# Altium schematic sheet 12-AM64x-01.SchDoc
size B; SheetNumber: 12; SheetTotal: 25
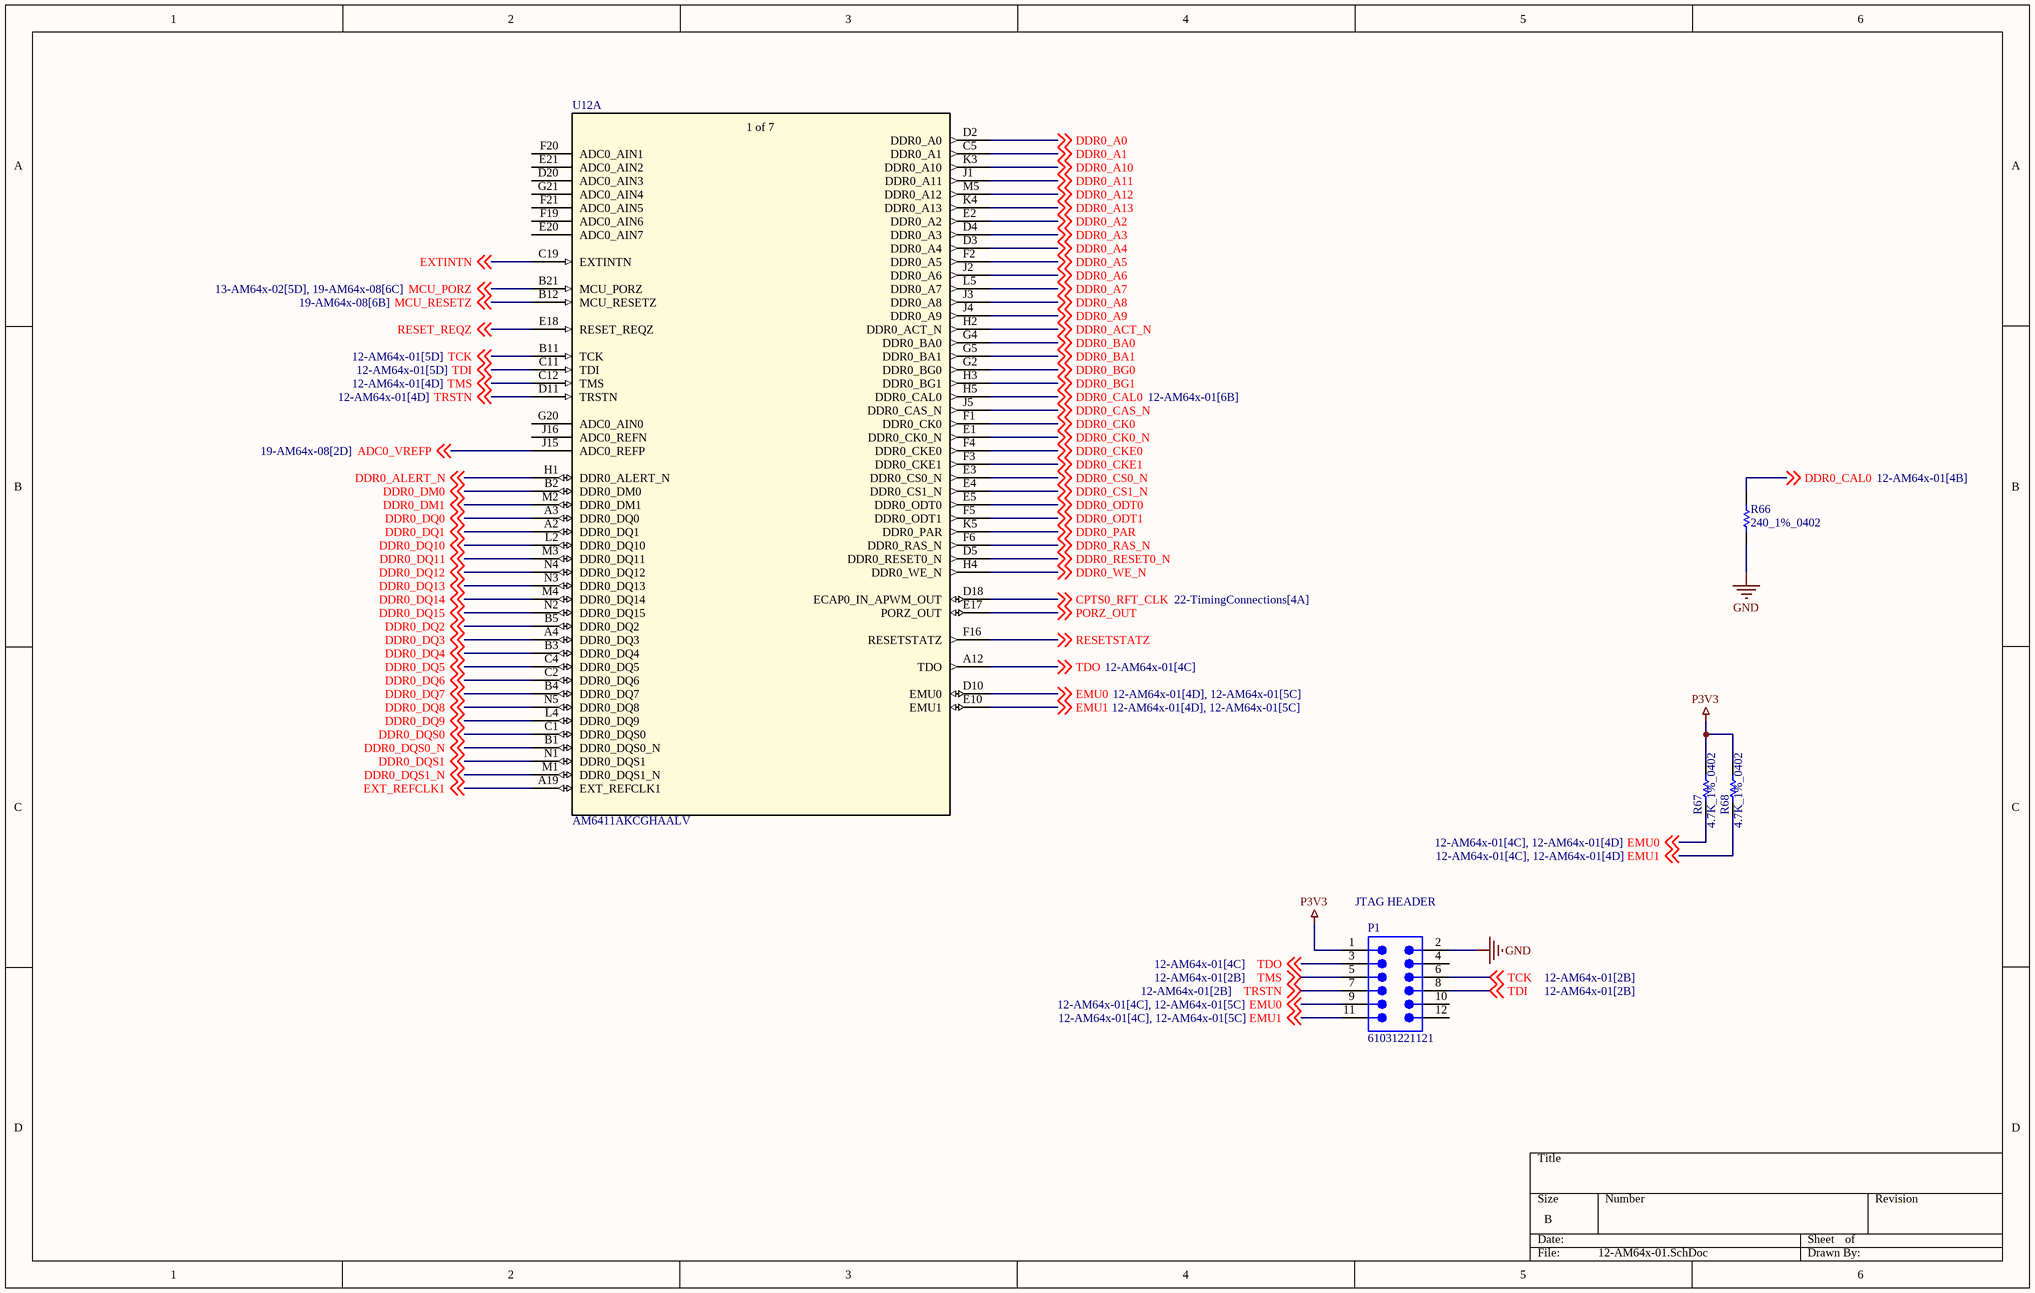
[diagram p0: 12-AM64x-01.SchDoc]

## Parts
P1  61031221121  [61031221121]
R66  240_1%_0402  [RESC1005X40X25ML05T05]
R67  4.7K_1%_0402  [RESC1005X40X25NL10T10]
R68  4.7K_1%_0402  [RESC1005X40X25NL10T10]
U12  AM6411AKCGHAALV  [FCBGA441_ALV_TEX]  (part A of 7)

## Nets
GND: P1.2 R66.1
P3V3: P1.1 R67.1 R68.1
ADC0_VREFP: U12.J15(ADC0_REFP) ; off-sheet ADC0_VREFP
CPTS0_RFT_CLK: U12.D18(ECAP0_IN_APWM_OUT) ; off-sheet CPTS0_RFT_CLK
DDR0_A0: U12.D2(DDR0_A0) ; off-sheet DDR0_A0
DDR0_A1: U12.C5(DDR0_A1) ; off-sheet DDR0_A1
DDR0_A2: U12.E2(DDR0_A2) ; off-sheet DDR0_A2
DDR0_A3: U12.D4(DDR0_A3) ; off-sheet DDR0_A3
DDR0_A4: U12.D3(DDR0_A4) ; off-sheet DDR0_A4
DDR0_A5: U12.F2(DDR0_A5) ; off-sheet DDR0_A5
DDR0_A6: U12.J2(DDR0_A6) ; off-sheet DDR0_A6
DDR0_A7: U12.L5(DDR0_A7) ; off-sheet DDR0_A7
DDR0_A8: U12.J3(DDR0_A8) ; off-sheet DDR0_A8
DDR0_A9: U12.J4(DDR0_A9) ; off-sheet DDR0_A9
DDR0_A10: U12.K3(DDR0_A10) ; off-sheet DDR0_A10
DDR0_A11: U12.J1(DDR0_A11) ; off-sheet DDR0_A11
DDR0_A12: U12.M5(DDR0_A12) ; off-sheet DDR0_A12
DDR0_A13: U12.K4(DDR0_A13) ; off-sheet DDR0_A13
DDR0_ACT_N: U12.H2(DDR0_ACT_N) ; off-sheet DDR0_ACT_N
DDR0_ALERT_N: U12.H1(DDR0_ALERT_N) ; off-sheet DDR0_ALERT_N
DDR0_BA0: U12.G4(DDR0_BA0) ; off-sheet DDR0_BA0
DDR0_BA1: U12.G5(DDR0_BA1) ; off-sheet DDR0_BA1
DDR0_BG0: U12.G2(DDR0_BG0) ; off-sheet DDR0_BG0
DDR0_BG1: U12.H3(DDR0_BG1) ; off-sheet DDR0_BG1
DDR0_CAL0: R66.2 U12.H5(DDR0_CAL0) ; off-sheet DDR0_CAL0
DDR0_CAS_N: U12.J5(DDR0_CAS_N) ; off-sheet DDR0_CAS_N
DDR0_CK0: U12.F1(DDR0_CK0) ; off-sheet DDR0_CK0
DDR0_CK0_N: U12.E1(DDR0_CK0_N) ; off-sheet DDR0_CK0_N
DDR0_CKE0: U12.F4(DDR0_CKE0) ; off-sheet DDR0_CKE0
DDR0_CKE1: U12.F3(DDR0_CKE1) ; off-sheet DDR0_CKE1
DDR0_CS0_N: U12.E3(DDR0_CS0_N) ; off-sheet DDR0_CS0_N
DDR0_CS1_N: U12.E4(DDR0_CS1_N) ; off-sheet DDR0_CS1_N
DDR0_DM0: U12.B2(DDR0_DM0) ; off-sheet DDR0_DM0
DDR0_DM1: U12.M2(DDR0_DM1) ; off-sheet DDR0_DM1
DDR0_DQ0: U12.A3(DDR0_DQ0) ; off-sheet DDR0_DQ0
DDR0_DQ1: U12.A2(DDR0_DQ1) ; off-sheet DDR0_DQ1
DDR0_DQ2: U12.B5(DDR0_DQ2) ; off-sheet DDR0_DQ2
DDR0_DQ3: U12.A4(DDR0_DQ3) ; off-sheet DDR0_DQ3
DDR0_DQ4: U12.B3(DDR0_DQ4) ; off-sheet DDR0_DQ4
DDR0_DQ5: U12.C4(DDR0_DQ5) ; off-sheet DDR0_DQ5
DDR0_DQ6: U12.C2(DDR0_DQ6) ; off-sheet DDR0_DQ6
DDR0_DQ7: U12.B4(DDR0_DQ7) ; off-sheet DDR0_DQ7
DDR0_DQ8: U12.N5(DDR0_DQ8) ; off-sheet DDR0_DQ8
DDR0_DQ9: U12.L4(DDR0_DQ9) ; off-sheet DDR0_DQ9
DDR0_DQ10: U12.L2(DDR0_DQ10) ; off-sheet DDR0_DQ10
DDR0_DQ11: U12.M3(DDR0_DQ11) ; off-sheet DDR0_DQ11
DDR0_DQ12: U12.N4(DDR0_DQ12) ; off-sheet DDR0_DQ12
DDR0_DQ13: U12.N3(DDR0_DQ13) ; off-sheet DDR0_DQ13
DDR0_DQ14: U12.M4(DDR0_DQ14) ; off-sheet DDR0_DQ14
DDR0_DQ15: U12.N2(DDR0_DQ15) ; off-sheet DDR0_DQ15
DDR0_DQS0: U12.C1(DDR0_DQS0) ; off-sheet DDR0_DQS0
DDR0_DQS0_N: U12.B1(DDR0_DQS0_N) ; off-sheet DDR0_DQS0_N
DDR0_DQS1: U12.N1(DDR0_DQS1) ; off-sheet DDR0_DQS1
DDR0_DQS1_N: U12.M1(DDR0_DQS1_N) ; off-sheet DDR0_DQS1_N
DDR0_ODT0: U12.E5(DDR0_ODT0) ; off-sheet DDR0_ODT0
DDR0_ODT1: U12.F5(DDR0_ODT1) ; off-sheet DDR0_ODT1
DDR0_PAR: U12.K5(DDR0_PAR) ; off-sheet DDR0_PAR
DDR0_RAS_N: U12.F6(DDR0_RAS_N) ; off-sheet DDR0_RAS_N
DDR0_RESET0_N: U12.D5(DDR0_RESET0_N) ; off-sheet DDR0_RESET0_N
DDR0_WE_N: U12.H4(DDR0_WE_N) ; off-sheet DDR0_WE_N
EMU0: P1.9 R67.2 U12.D10(EMU0) ; off-sheet EMU0
EMU1: P1.11 R68.2 U12.E10(EMU1) ; off-sheet EMU1
EXT_REFCLK1: U12.A19(EXT_REFCLK1) ; off-sheet EXT_REFCLK1
EXTINTN: U12.C19(EXTINTN) ; off-sheet EXTINTN
MCU_PORZ: U12.B21(MCU_PORZ) ; off-sheet MCU_PORZ
MCU_RESETZ: U12.B12(MCU_RESETZ) ; off-sheet MCU_RESETZ
PORZ_OUT: U12.E17(PORZ_OUT) ; off-sheet PORZ_OUT
RESET_REQZ: U12.E18(RESET_REQZ) ; off-sheet RESET_REQZ
RESETSTATZ: U12.F16(RESETSTATZ) ; off-sheet RESETSTATZ
TCK: P1.6 U12.B11(TCK) ; off-sheet TCK
TDI: P1.8 U12.C11(TDI) ; off-sheet TDI
TDO: P1.3 U12.A12(TDO) ; off-sheet TDO
TMS: P1.5 U12.C12(TMS) ; off-sheet TMS
TRSTN: P1.7 U12.D11(TRSTN) ; off-sheet TRSTN

Not connected (* = marked no-connect by the designer): P1 4 10 12; U12 D20(ADC0_AIN3) E20(ADC0_AIN7) E21(ADC0_AIN2) F19(ADC0_AIN6) F20(ADC0_AIN1) F21(ADC0_AIN5) G20(ADC0_AIN0) G21(ADC0_AIN4) J16(ADC0_REFN)

## Notes on the sheet
- (near P1) JTAG HEADER
- (in symbol AM6411AKCGHAALV, part A) 1 of 7

## Library data of the parts
P1 = CMP-1502-01054-2: NexarPartId: 32855452; Number of Positions: 12; Current Rating: 3A; Pitch: 2.54mm; Gender: Male; Connector Type: Male Pin; Operating Supply Voltage: 250V; Contact Resistance: 20mΩ; Contact Plating: Gold; Number of Rows: 2; Lead Pitch: 2.54mm; Color: Black; Mount: Surface Mount; Packaging: Tape and Reel; Contact Mating Length: 5.9944mm; REACH SVHC: Unknown; Contact Material: Copper; Row Spacing: 2.54mm; Number of Pins: 12; Orientation: Vertical; Termination: Solder; RoHS: Compliant; Number of Contacts: 12
R66 = CMP-2002-08397-1: Manufacturer: Vishay Dale; Part Number: CRCW0402240RFKED
R67 R68 = CMP-2002-05217-1: Manufacturer: Bourns; Part Number: CR0402-FX-4701GLF
U12 = AM6411AKCGHAALV: No Description Available; Mfr_Name: Texas Instruments; RefDes: RefDes; Type: Type